# EAGLE design XenoPreamp (EAGLE 6.5.0)
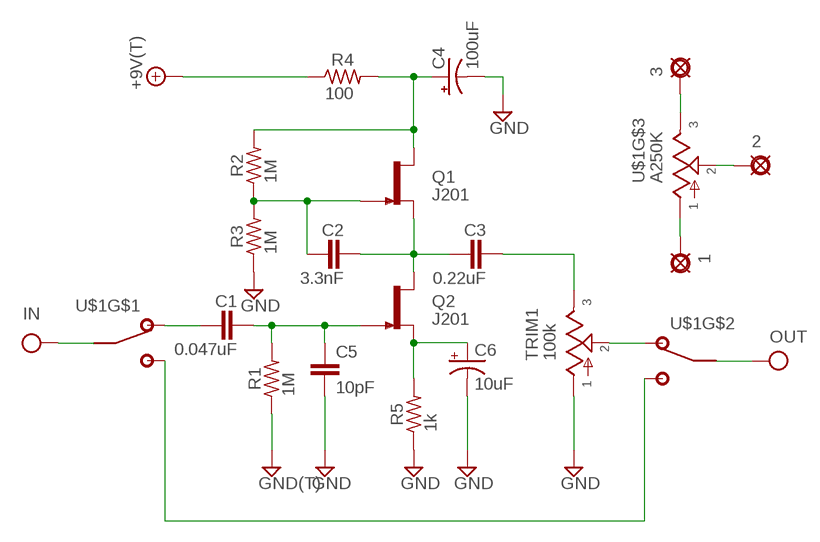
[diagram p0: schematic, sheet 1]

## Parts
1  VOLIN  PAD8  [OCTOGON]
2  VOLOUT  PAD8  [OCTOGON]
3  GNF  PAD8  [OCTOGON]
+9V  +9V(T)  [SQUARE]
C1  0.047uF  072X0252  [072X025]
C2  3.3nF  072X0252  [072X025]
C3  0.22uF  072X0252  [072X025]
C4  100uF  0631  [063_025]
C5  10pF  050X030_0251  [050X030_025]
C6  10uF  0501  [050_020_1]
GND  GND(T)  [SQUARE]
IN  IN(T)  [SQUARE]
OUT  OUT(T)  [SQUARE]
Q1  J201  [TO92-]
Q2  J201  [TO92-]
R1  1M  6MM.3  [R0207/3]
R2  1M  6MM.3  [R0207/3]
R3  1M  6MM.3  [R0207/3]
R4  100  6MM.3  [R0207/3]
R5  1k  6MM.3  [R0207/3]
TRIM1  100k  POTTRIM  [B25P]
U$1  A250K  16MMDPDT  [16MM-PCB-MOUNT-DPDT]

## Nets
+9V: +9V.1(+9V) R4.1
GND: C4.- C5.2 C6.- GND.1(GND) R1.1 R3.1 R5.1 TRIM1.1
IN: IN.1(IN) U$1.SA2
N$1: C6.+ Q2.2(S) R5.2
N$2: C2.1 Q1.1(G) R2.1 R3.2
N$3: C4.+ Q1.3(D) R2.2 R4.2
N$4: C2.2 C3.1 Q1.2(S) Q2.3(D)
N$5: C1.2 C5.1 Q2.1(G) R1.2
N$6: C3.2 TRIM1.3
N$7: 3.1(PAD) U$1.3
N$8: 2.1(PAD) U$1.2
N$9: 1.1(PAD) U$1.1
N$10: U$1.SA3 U$1.SB3
N$11: TRIM1.2 U$1.SB1
N$12: C1.1 U$1.SA1
OUT: OUT.1(OUT) U$1.SB2

## Library data of the parts
1-3 = mb_supply:PAD: PAD use this package for pads with any purpose, including input, output, send or return various pad shapes: round, square, octogonal, long, and long offset
+9V = mb_supply:+9V(T): +9V Voltage Supply use this to hook up +9v throughout a schematic instead of running wire automatically labels the net "+9v" adds a hookup pad to the circuit board
C1-C3 = mb_caps-box:072X025: 1000pF - 0.47uF WIMA MKP2 63, 100V: 1000pF - 0.015uF; MKS2 50V: 0.33 - 0.47uF; 63V: 1000pF - 0.22uF;
C4 = mb_caps-electro:063: 33 - 220uF Xicon values at Mouser.com 10V: 220uF; 16V: 100uF; 25V: 100uF; 50V: 33uF
C5 = mb_caps-ceramic:050X030_025: 47 - 120pF Xicon Ceramic Disc 2.5mm lead spacing
C6 = mb_caps-electro:050: 0.22 - 100uF Xicon values at Mouser.com: 10V: 10 - 100uF; 16V: 2.2 - 47uF; 25V: 0.47 - 47uF; 50V: 0.22 - 22uF
GND = mb_supply:GND(T): Ground use this to hook up ground (GND) throughout a schematic instead of running wire automatically labels the net "GND" adds a hookup pad to the circuit board (you can use several)
IN = mb_supply:IN(T): Input obsolete: use Pad instead and label net shematic input label with circuit board terminal/pad generally used only once on a schematic (because this device labels the net "IN" in the same way as a voltage supply or ground net)
OUT = mb_supply:OUT(T): Output obsolete: use Pad instead and label net output label with circuit board terminal/pad usually appears only once on a schematic
Q1 Q2 = mb_trans:J201: N-channel JFET
R1-R5 = mb_resistors:6MM: 6mm Resistors Leads spaced 1-6 holes apart for 0.1" perfboard. Suitable for 1/4 watt resistors.
TRIM1 = mb_pots:POT: Potentiometers the arrow indicates the clockwise motion of th wiper (lug 2) fully counter clockwise there is no resistance between lugs 1 and 2 fully clockwise the resistance between lugs 1 and 2 is the value of the pot
U$1 = Alpha-DPDTPot:16MMDPDT: 16MMPOT with DPDT Switch

## Board
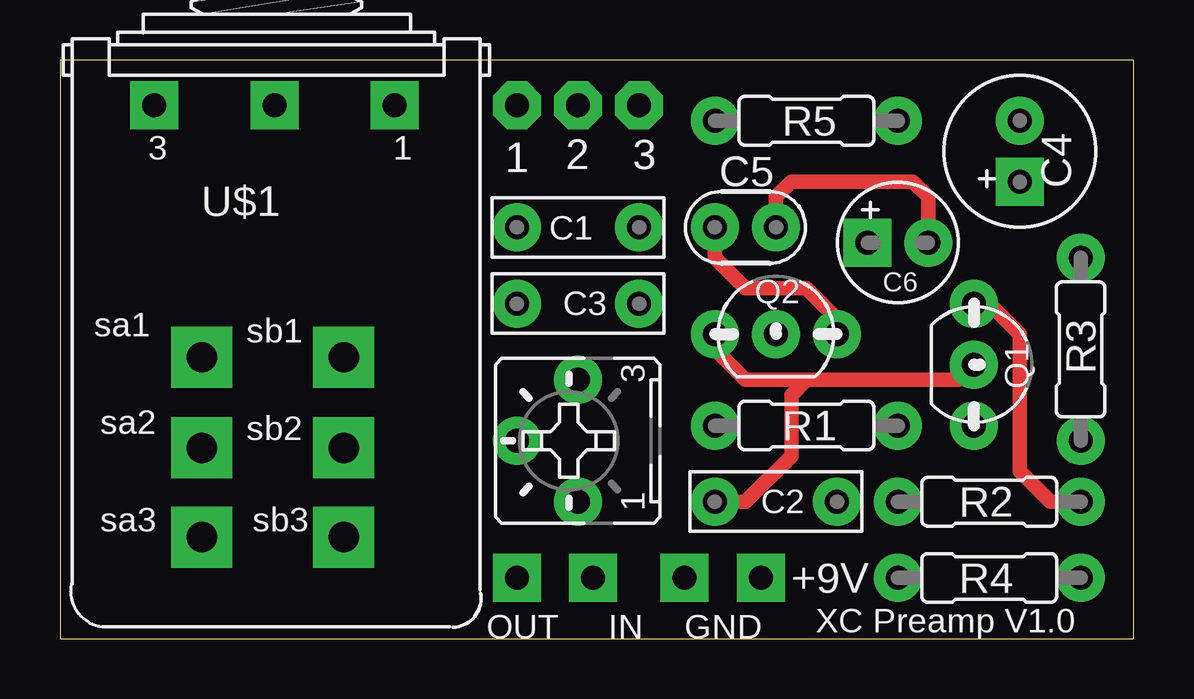
[diagram p1: board, top side]
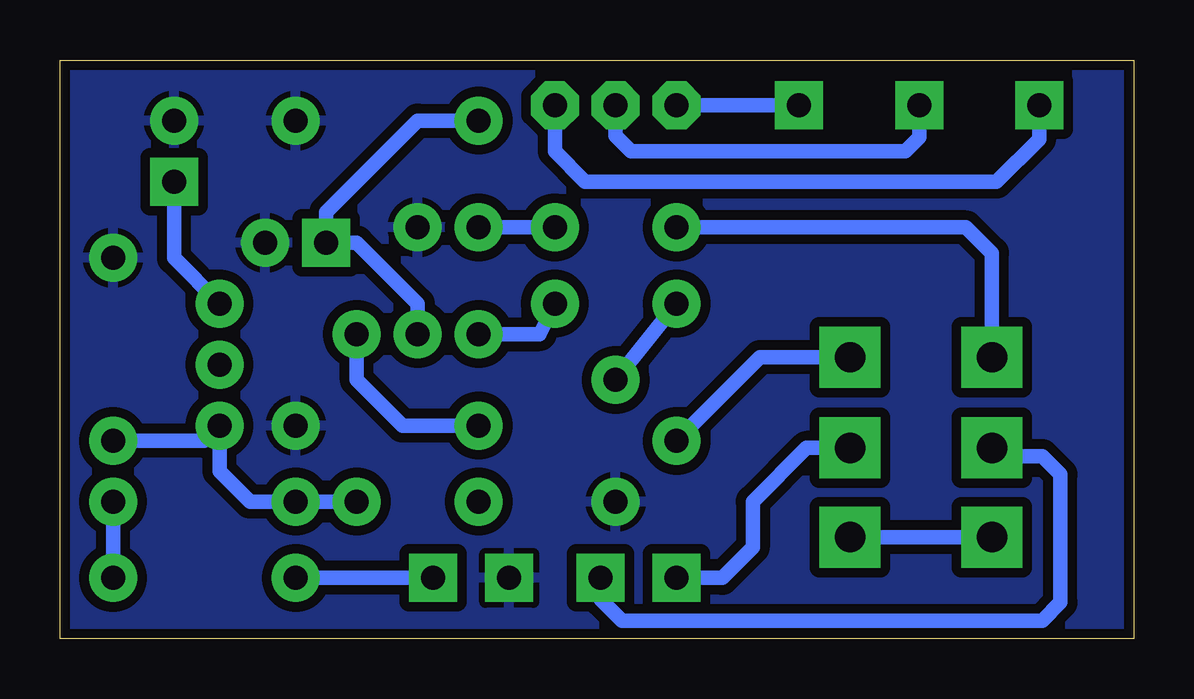
[diagram p2: board, bottom side, seen from below]

Size 44.76 x 24.12 mm. Coordinates in mm from the lower left corner, seen from the top.
Outline: 0,0 44.76,0 44.76,24.12 0,24.12 0,0
Copper layers (1*16): Top 0.0356mm / dielectric 1.5011mm / Bottom 0.0356mm
Design rules "LaenPCBOrder": minimum track width 6mil, minimum drill 13mil, track to track 6mil, track to pad 6mil, pad to pad 6mil, via to via 6mil, smd to smd 6mil, copper to edge 15mil, drill to drill 6mil, minimum pad ring 7mil, minimum via ring 7mil, stop-mask expansion 3mil, vias tented up to drill 0mil, thermal gap 10mil

### Footprints (pad centres in the part's own frame; a part is rotated, then mirrored left to right if it is on the bottom)
OCTOGON = drill 1 pad 2 octagon: 1 0,0
SQUARE = drill 1 pad 2 square: 1 0,0
072X025 = drill 1 pad 2: 1 -2.54,0; 2 2.54,0
063_025 = drill 1 pad 2 square: + -1.27,0 | drill 1 pad 2: - 1.27,0
050X030_025 = drill 1 pad 2: 1 -1.27,0; 2 1.27,0
050_020_1 = drill 1 pad 2 square: + -1.27,0 | drill 1 pad 2: - 1.27,0
TO92- = drill 1 pad 2: 1 2.54,0; 2 0,0; 3 -2.54,0
R0207/3 = drill 1 pad 2: 1 -3.81,0; 2 3.81,0
B25P = drill 1 pad 2: 1 -2.54,0; 2 0,2.54; 3 2.54,0
16MM-PCB-MOUNT-DPDT = drill 1 pad 2 square: 1 5.055,0; 2 0.051,0; 3 -4.953,0 | drill 1.27 pad 2.54 square: SA1 -2.982,-10.49; SA2 -2.982,-14.27; SA3 -2.982,-17.986; SB1 2.934,-10.49; SB2 2.934,-14.27; SB3 2.934,-17.986

### Placement (x,y rotation side)
1  19.05,22.23 0 top
2  21.59,22.23 0 top
3  24.13,22.23 0 top
+9V  29.21,2.54 0 top
C1  21.59,17.14 0 top
C2  29.84,5.71 180 top
C3  21.59,13.97 180 top
C4  40.01,20.32 90 top
C5  28.57,17.14 0 top
C6  34.92,16.51 0 top
GND  26.04,2.54 0 top
IN  22.23,2.54 0 top
OUT  19.05,2.54 0 top
Q1  38.1,11.43 270 top
Q2  29.84,12.7 0 top
R1  31.11,8.89 180 top
R2  38.73,5.71 0 top
R3  42.55,12.06 270 top
R4  38.73,2.54 0 top
R5  31.11,21.59 180 top
TRIM1  21.59,8.26 90 top
U$1  8.89,22.23 0 top

### Tracks (layer width: path | path; a pad name or v marks a point on that pad's centre or on a via)
+9V
  Bottom 0.61: +9V.1 R4.1
GND
  Top 0.61: C5.2 29.84,18.41 30.48,19.05 35.56,19.05 36.2,18.41 C6.-
  pour Bottom (isolate 0.406): 0,0 0,24.13 44.45,24.13 44.45,0
IN
  Bottom 0.61: IN.1 22.23,1.65 21.34,0.76 3.81,0.76 3.05,1.52 3.05,6.86 3.81,7.62 5.57,7.62 U$1.SA2
N$1
  Bottom 0.61: R5.2 29.84,21.59 33.66,17.78 C6.+ 32.38,16.51 29.84,13.97 Q2.2
N$2
  Bottom 0.61: C2.1 R2.1 36.83,5.71 38.1,6.99 Q1.1 38.73,8.26 R3.2
N$3
  Top 0.61: R2.2 41.27,5.71 40.01,6.99 40.01,12.7 38.73,13.97 Q1.3
  Bottom 0.61: R4.2 R2.2 | Q1.3 40.01,15.88 C4.+
N$4
  Top 0.61: C2.2 28.57,5.71 30.48,7.62 30.48,10.16 31.11,10.79 | 31.11,10.79 37.47,10.79 Q1.2 | Q2.3 27.3,12.06 28.57,10.79 31.11,10.79
  Bottom 0.61: Q2.3 24.77,12.7 C3.1
N$5
  Top 0.61: Q2.1 32.38,13.34 31.11,14.61 28.57,14.61 27.3,15.88 C5.1
  Bottom 0.61: C1.2 C5.1 | R1.2 30.48,8.89 32.38,10.79 Q2.1
N$6
  Bottom 0.61: TRIM1.3 C3.2
N$7
  Bottom 0.61: U$1.3 3.94,20.83 5.71,19.05 22.86,19.05 24.13,20.32 3.1
N$8
  Bottom 0.61: U$1.2 8.94,20.9 9.53,20.32 20.95,20.32 21.59,20.95 2.1
N$9
  Bottom 0.61: 1.1 U$1.1
N$10
  Bottom 0.61: U$1.SA3 U$1.SB3
N$11
  Bottom 0.61: U$1.SB1 15.57,11.73 TRIM1.2
N$12
  Bottom 0.61: U$1.SA1 5.91,16.07 6.99,17.14 C1.1
OUT
  Bottom 0.61: U$1.SB2 13.63,7.96 15.88,5.71 15.88,3.81 17.14,2.54 OUT.1

### Text on the board
tNames: XC Preamp V1.0